# EAGLE design nrf52_breakout_rev_1 (EAGLE 9.1.3)
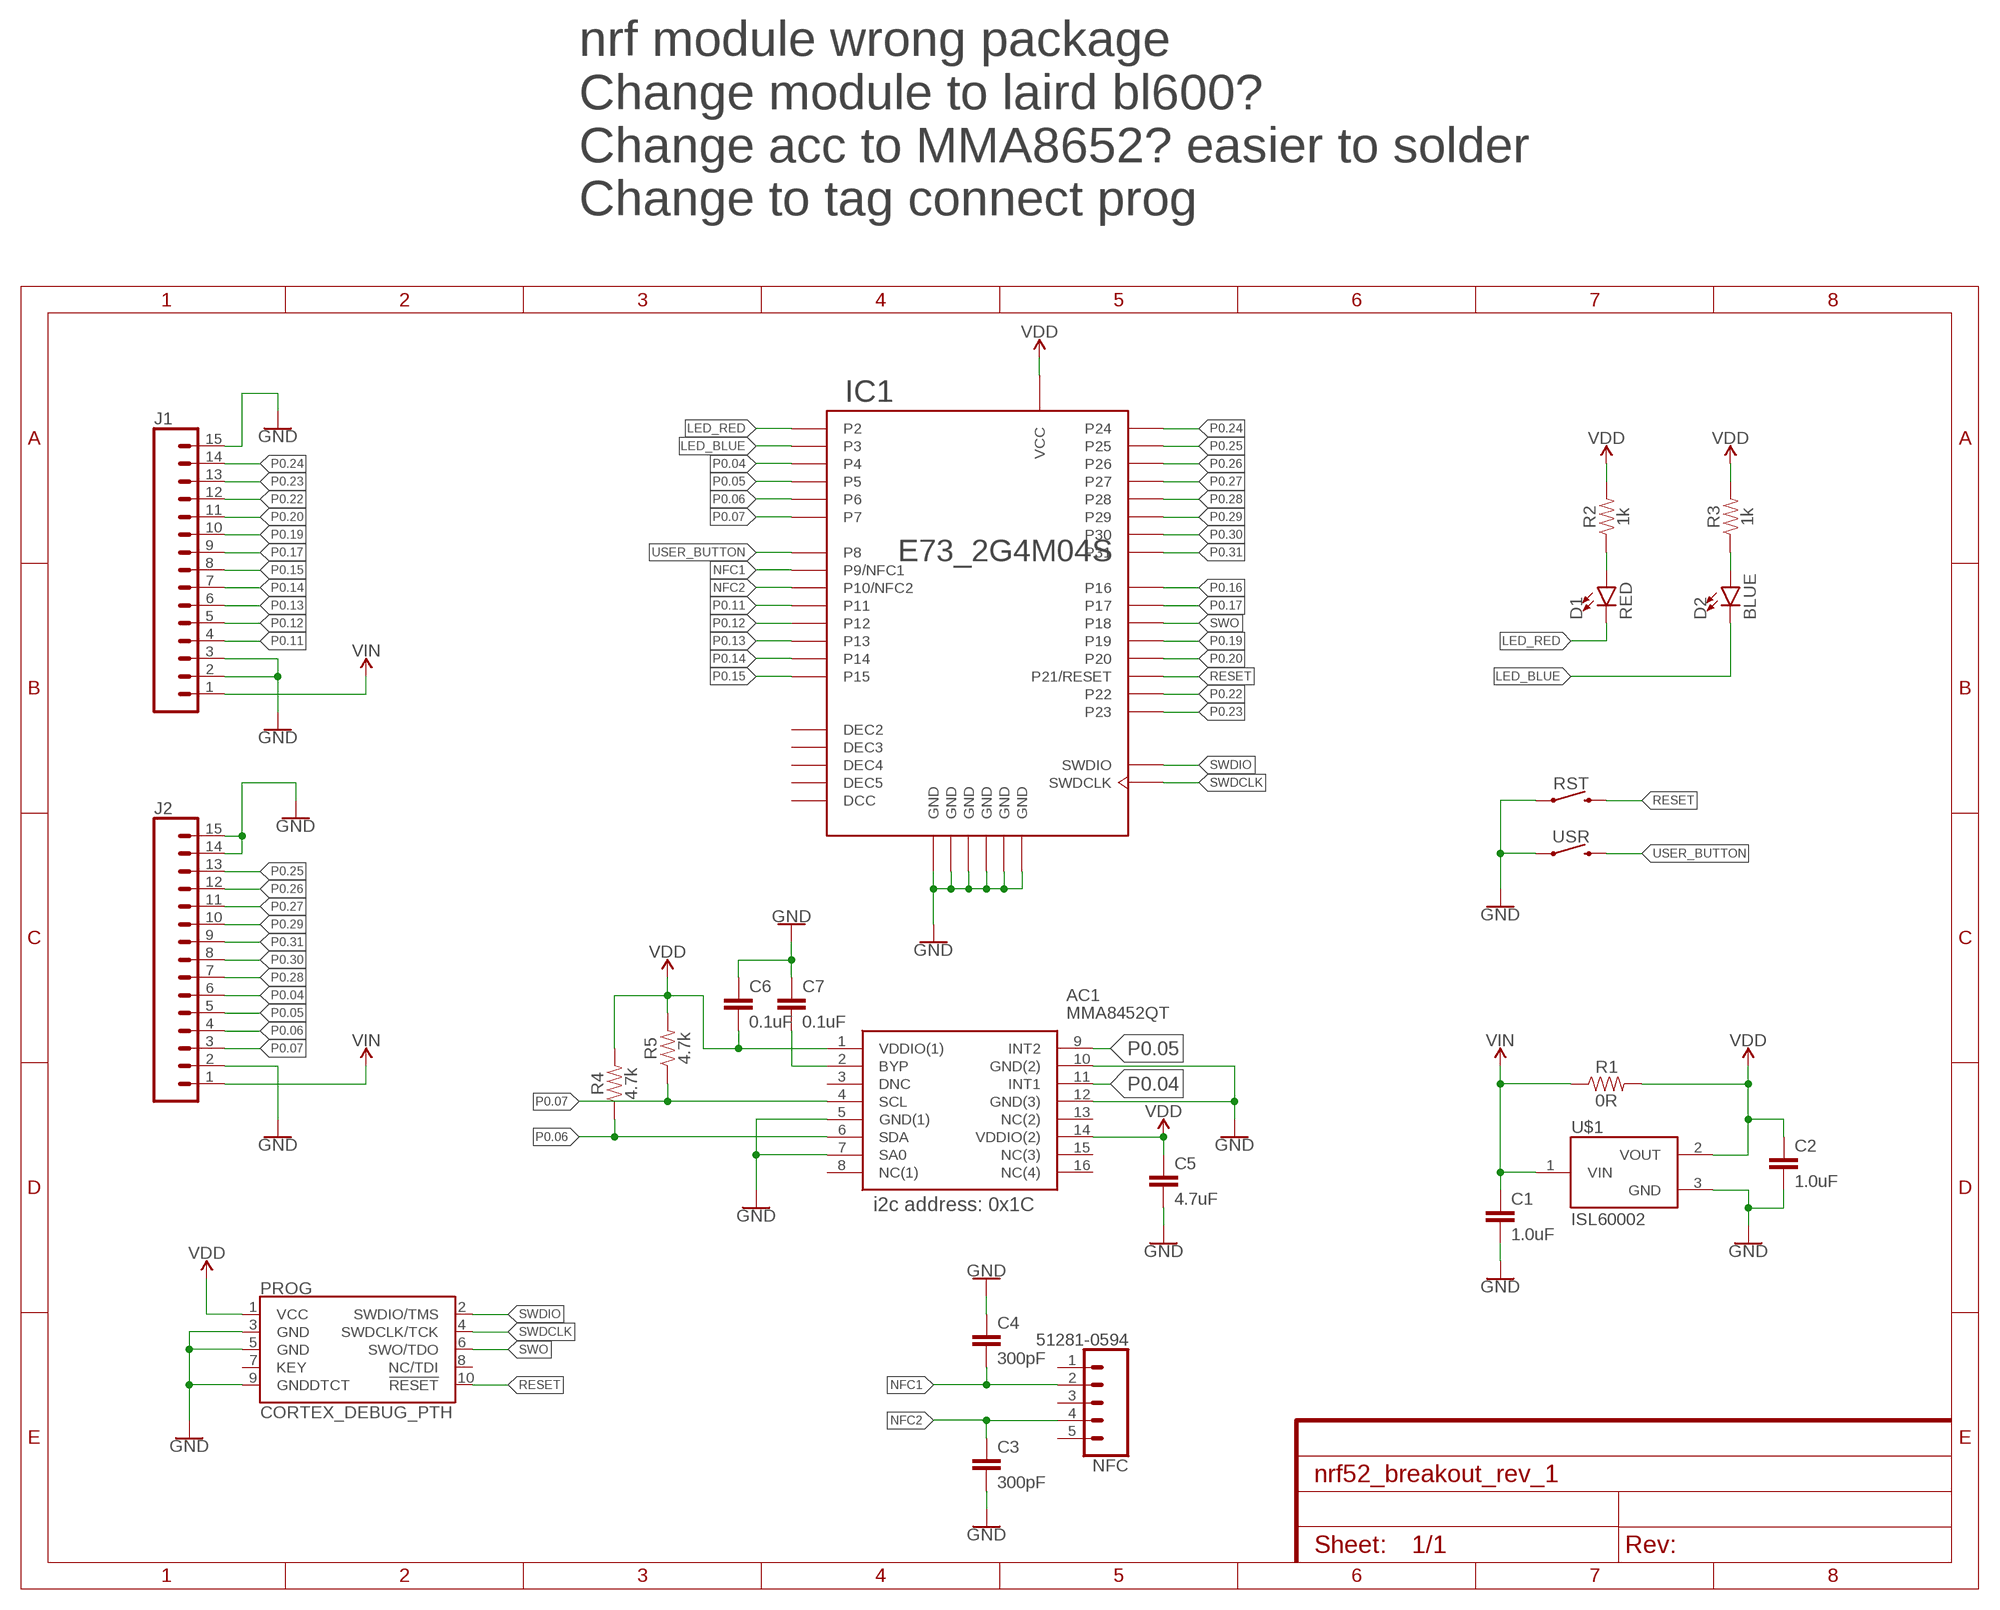
[diagram p0: schematic, sheet 1]

## Parts
AC1  MMA8452QT  [PQFN50P300X300X100-16N]
C1  1.0uF  1.0UF-0603-16V-10%  [0603]
C2  1.0uF  1.0UF-0603-16V-10%  [0603]
C3  300pF  470NF-0402-16V-10%  [0402]
C4  300pF  470NF-0402-16V-10%  [0402]
C5  4.7uF  4.7UF0603  [0603]
C6  0.1uF  0.1UF-0402-16V-10%  [0402]
C7  0.1uF  0.1UF-0402-16V-10%  [0402]
D1  RED  LED-RED0603  [LED-0603]
D2  BLUE  LED-BLUE0603  [LED-0603]
IC1  E73_2G4M04S  [E73_2G4M04S]
J1  CONN_15  [1X15]
J2  CONN_15  [1X15]
NFC  51281-0594  [51281-0594]
PROG  CORTEX_DEBUG_PTH  [2X5-PTH-1.27MM]
R1  0R  RESISTOR0603  [0603]
R2  1k  RESISTOR0603  [0603]
R3  1k  RESISTOR0603  [0603]
R4  4.7k  RESISTOR0402  [0402]
R5  4.7k  RESISTOR0402  [0402]
RST  MOMENTARY-SWITCH-SPST-SMD-4.6X2.8MM  [TACTILE_SWITCH_SMD_4.6X2.8MM]
U$1  ISL60002  [SOT23-3]
USR  MOMENTARY-SWITCH-SPST-SMD-4.6X2.8MM  [TACTILE_SWITCH_SMD_4.6X2.8MM]

## Nets
GND: AC1.5(GND(1)) AC1.7(SA0) AC1.10(GND(2)) AC1.12(GND(3)) C1.2 C2.2 C3.2 C4.1 C5.2 C6.1 C7.1 IC1.0(GND) IC1.1(GND) IC1.2(GND) IC1.15(GND) IC1.42(GND) IC1.43(GND) J1.2 J1.3 J1.15 J2.2 J2.14 J2.15 PROG.3(GND) PROG.5(GND) PROG.9(GNDDTCT) RST.1 RST.2 U$1.3(GND) USR.1 USR.2
LED_BLUE: D2.C IC1.18(P3)
LED_RED: D1.C IC1.17(P2)
N$1: D2.A R3.1
N$2: D1.A R2.1
N$6: AC1.2(BYP) C7.2
NFC1: C4.2 IC1.24(P9/NFC1) NFC.2
NFC2: C3.1 IC1.25(P10/NFC2) NFC.4
P0.04: AC1.11(INT1) IC1.19(P4) J2.6
P0.05: AC1.9(INT2) IC1.20(P5) J2.5
P0.06: AC1.6(SDA) IC1.21(P6) J2.4 R4.1
P0.07: AC1.4(SCL) IC1.22(P7) J2.3 R5.1
P0.11: IC1.26(P11) J1.4
P0.12: IC1.27(P12) J1.5
P0.13: IC1.28(P13) J1.6
P0.14: IC1.29(P14) J1.7
P0.15: IC1.30(P15) J1.8
P0.16: IC1.31(P16)
P0.17: IC1.32(P17) J1.9
P0.19: IC1.34(P19) J1.10
P0.20: IC1.35(P20) J1.11
P0.22: IC1.39(P22) J1.12
P0.23: IC1.40(P23) J1.13
P0.24: IC1.41(P24) J1.14
P0.25: IC1.5(P25) J2.13
P0.26: IC1.6(P26) J2.12
P0.27: IC1.7(P27) J2.11
P0.28: IC1.8(P28) J2.7
P0.29: IC1.9(P29) J2.10
P0.30: IC1.10(P30) J2.8
P0.31: IC1.11(P31) J2.9
RESET: IC1.36(P21/RESET) PROG.10(!RESET) RST.3 RST.4
SWDCLK: IC1.37(SWDCLK) PROG.4(SWDCLK/TCK)
SWDIO: IC1.38(SWDIO) PROG.2(SWDIO/TMS)
SWO: IC1.33(P18) PROG.6(SWO/TDO)
USER_BUTTON: IC1.23(P8) USR.3 USR.4
VDD: AC1.1(VDDIO(1)) AC1.14(VDDIO(2)) C2.1 C5.1 C6.2 IC1.16(VCC) PROG.1(VCC) R1.2 R2.2 R3.2 R4.2 R5.2 U$1.2(VOUT)
VIN: C1.1 J1.1 J2.1 R1.1 U$1.1(VIN)
Unconnected: AC1.3(DNC) AC1.8(NC(1)) AC1.13(NC(2)) AC1.15(NC(3)) AC1.16(NC(4)) NFC.1 NFC.3 NFC.5 PROG.7(KEY) PROG.8(NC/TDI)

## Notes on the sheet
- nrf module wrong package
  Change module to laird bl600?
  Change acc to MMA8652? easier to solder
  Change to tag connect prog
- i2c address: 0x1C

## Power pins joined to a net without a drawn wire
DCC: IC1.13(DCC)
DEC2: IC1.3(DEC2)
DEC3: IC1.4(DEC3)
DEC4: IC1.12(DEC4)
DEC5: IC1.14(DEC5)

## Library data of the parts
AC1 = BauckLib:MMA8452QT: Accelerometers LOW G 3-AXIS 12BT EX VLT Source: Datasheet <http://docs-europe.electrocomponents.com/webdocs/12de/0900766b812de994.pdf>; DESCRIPTION: Accelerometers LOW G 3-AXIS 12BT EX VLT; HEIGHT: 1mm; MANUFACTURER_NAME: Nexperia; MANUFACTURER_PART_NUMBER: MMA8452QT; RS_PART_NUMBER: 9227526; SUPPLIER_NAME: RS
C1 C2 = SparkFun-Capacitors:1.0UF: 1µF ceramic capacitors A capacitor is a passive two-terminal electrical component used to store electrical energy temporarily in an electric field.; PROD_ID: CAP-00868
C3 C4 = SparkFun-Capacitors:470NF: 0.47uF/470nF ceramic capacitors A capacitor is a passive two-terminal electrical component used to store electrical energy temporarily in an electric field.; PROD_ID: CAP-09041; VALUE: 470nF
C5 = SparkFun-Capacitors:4.7UF: 4.7µF ceramic capacitors A capacitor is a passive two-terminal electrical component used to store electrical energy temporarily in an electric field.; PROD_ID: CAP-08280
C6 C7 = SparkFun-Capacitors:0.1UF: 0.1µF ceramic capacitors A capacitor is a passive two-terminal electrical component used to store electrical energy temporarily in an electric field.; PROD_ID: CAP-12416
D1 = SparkFun-LED:LED-RED: Red SMD LED Used in manufacturing of most products at SparkFun Packages: 0603 - SMD 0603 package [Product Link] <http://docs.avagotech.com/docs/AV02-0551EN> 0603 SMART - SMD 0603 SMART package ( more efficient and expensive)[Product Link] <http://www.osram-os.com/Graphics/XPic2/00077099_0.pdf> 1206 - SMD1206 package [Product Link] <https://www.sparkfun.com/datasheets/DevTools/LilyPad/Q150OVS4.pdff> SparkFun Products: Pro Mini 328 -5V <https://www.sparkfun.com/products/821> RedBoard <https://www.sparkfun.com/products/12757> IOIO-OTG <https://www.sparkfun.com/products/13613>; PROD_ID: DIO-00819
D2 = SparkFun-LED:LED-BLUE: Blue SMD LED Used in manufacturing of various products at SparkFun Packages: 0603 - SMD 0603 package [Product Link] <http://www.digikey.com/product-detail/en/SMLE12BC7TT86/511-1589-2-ND/1641808> 1206 - SMD1206 package [Product Link] <http://www.digikey.com/product-detail/en/lite-on-inc/LTST-C150TBKT/160-1643-1-ND/573584> SparkFun Products: ESP8266 Thing-Dev Board <https://www.sparkfun.com/products/13711> RedBoard <https://www.sparkfun.com/products/12757>; PROD_ID: DIO-08575
IC1 = BauckLib:E73_2G4M04S
J1 J2 = SparkFun-Connectors:CONN_15: Multi connection point. Often used as Generic Header-pin footprint for 0.1 inch spaced/style header connections On any of the 0.1 inch spaced packages, you can populate with these: Break Away Headers - Straight <https://www.sparkfun.com/products/116> (PRT-00116) Break Away Male Headers - Right Angle <https://www.sparkfun.com/products/553> (PRT-00553) Female Headers <https://www.sparkfun.com/products/115> (PRT-00115) Break Away Headers - Machine Pin <https://www.sparkfun.com/products/117> (PRT-00117) Break Away Female Headers - Swiss Machine Pin <https://www.sparkfun.com/products/743> (PRT-00743) For SCREWTERMINALS and SPRING TERMINALS visit here: Screw Terimnals on SparkFun.com <https://www.sparkfun.com/search/results?term=Screw+Terminals> (5mm/3.5mm/2.54mm spacing) This device is also useful as a general connection point to wire up your design to another part of your project. Our various solder wires solder well into these plated through hole pads. Hook-Up Wire - Assortment (Stranded, 22 AWG) <https://www.sparkfun.com/products/11375> (PRT-11375) Hook-Up Wire - Assortment (Solid Core, 22 AWG) <https://www.sparkfun.com/products/11367> (PRT-11367) View the entire wire category on our website here <https://www.sparkfun.com/categories/141> Special notes: Molex polarized connector foot print use with SKU : PRT-08231 with associated crimp pins and housings. 1MM SMD Version SKU: PRT-10208 NOTES ON THE VARIANTS LOCK and LOCK_LONGPADS... This footprint was designed to help hold the alignment of a through-hole component (i.e. 6-pin header) while soldering it into place. You may notice that each hole has been shifted either up or down by 0.005 of an inch from it's more standard position (which is a perfectly straight line). This slight alteration caused the pins (the squares in the middle) to touch the edges of the holes. Because they are alternating, it causes a "brace" to hold the component in place. 0.005 has proven to be the perfect amount of "off-center" position when using our standard breakaway headers. Although looks a little odd when you look at the bare footprint, once you have a header in there, the alteration is very hard to notice. Also,if you push a header all the way into place, it is covered up entirely on the bottom side.
NFC = BauckLib:51281-0594: FFC & FPC Connectors 0.5 FPC Non-ZIF 5Ckt Dual Contact Source: Datasheet <http://www.molex.com/pdm_docs/sd/512810594_sd.pdf>; DESCRIPTION: FFC & FPC Connectors 0.5 FPC Non-ZIF 5Ckt Dual Contact; HEIGHT: mm; MANUFACTURER_NAME: Molex; MANUFACTURER_PART_NUMBER: 51281-0594; SUPPLIER_NAME: RS
PROG = SparkFun-Connectors:CORTEX_DEBUG: Cortex Debug Connector - 10 pin Supports JTAG debug, Serial Wire debug, and Serial Wire Viewer. PTH and SMD connector options available. General Connector Information <http://infocenter.arm.com/help/topic/com.arm.doc.faqs/attached/13634/cortex_debug_connectors.pdf> Products: PTH Connector <http://www.digikey.com/product-detail/en/cnc-tech/3220-10-0100-00/1175-1627-ND/3883661> -via Digi-Key SparkFun PSoc <https://www.sparkfun.com/products/13229> SparkFun T <https://www.sparkfun.com/products/13810>
R1-R5 = SparkFun-Resistors:RESISTOR: Generic Resistor Package
RST USR = SparkFun-Switches:MOMENTARY-SWITCH-SPST: Momentary Switch (Pushbutton) - SPST Normally-open (NO) SPST momentary switches (buttons, pushbuttons). Variants PTH-12MM - 12mm square, through-hole Momentary Pushbutton Switch - 12mm Square <https://www.sparkfun.com/products/9190> (COM-09190) PTH-6.0MM, PTH-6.0MM-KIT - 6.0mm square, through-hole Mini Pushbutton Switch <https://www.sparkfun.com/products/97> (COM-00097) KIT package intended for soldering kit's - only one side of pads' copper is exposed. PTH-RIGHT-ANGLE-KIT - Right-angle, through-hole Right Angle Tactile Button <https://www.sparkfun.com/products/10791> - Used on SparkFun BigTime Watch Kit <https://www.sparkfun.com/products/11734> SMD-12MM - 12mm square, surface-mount Tactile Button - SMD (12mm) <https://www.sparkfun.com/products/12993> (COM-12993) Used on SparkFun PicoBoard <https://www.sparkfun.com/products/11888> SMD-4.5MM - 4.5mm Square Trackball Switch Used on SparkFun Blackberry Trackballer Breakout <https://www.sparkfun.com/products/13169> SMD-4.6MMX2.8MM - 4.60mm x 2.80mm, surface mount Used on SparkFun SAMD21 Mini Breakout <https://www.sparkfun.com/products/13664> SMD-5.2MM, SMD-5.2-REDUNDANT - 5.2mm square, surface-mount Mini Pushbutton Switch - SMD <https://www.sparkfun.com/products/8720> (COM-08720) Used on Arduino Pro Mini <https://www.sparkfun.com/products/11114> REDUNDANT package connects both switch circuits together SMD-6.0X3.5MM - 6.0 x 3.5mm, surface mount Momentary Reset Switch SMD <https://www.sparkfun.com/products/8229> (COM-08229) SMD-6.2MM-TALL - 6.2mm square, surface mount Tactile Button - SMD (6mm) <https://www.sparkfun.com/products/12992> Used on SparkFun Digital Sandbox <https://www.sparkfun.com/products/12651> SMD-RIGHT-ANGLE - Right-angle, surface mount Used on SparkFun Block for Intel® Edison - Arduino <https://www.sparkfun.com/products/13036>; PROD_ID: SWCH-13065
U$1 = BauckLib:ISL60002

## Board
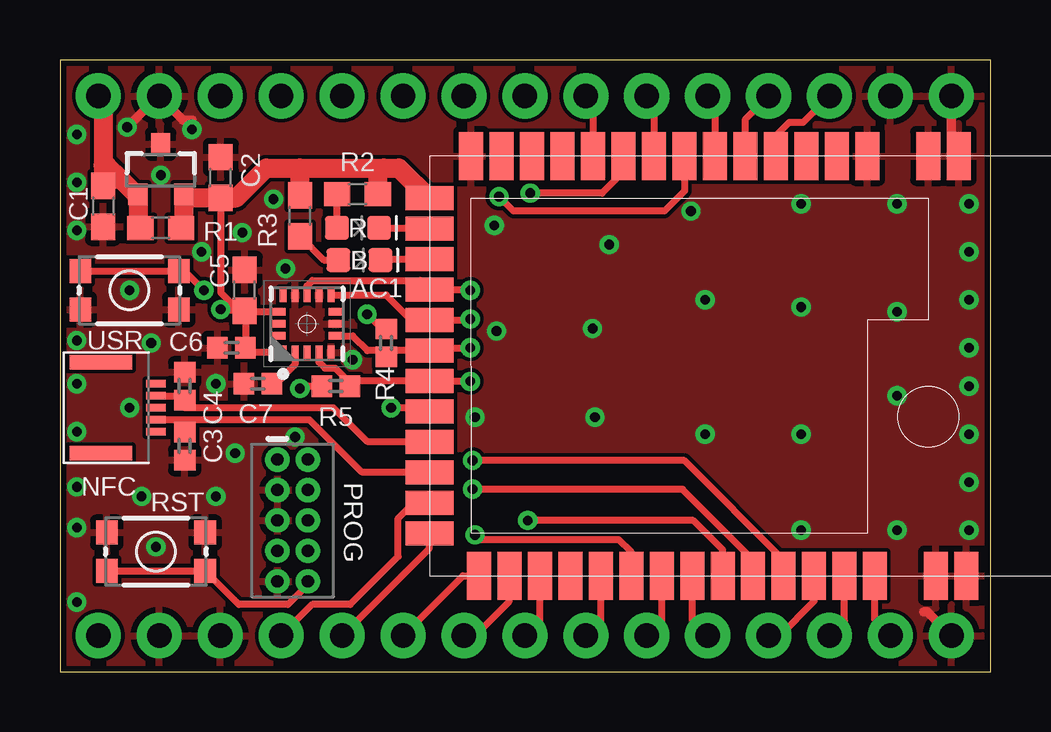
[diagram p1: board, top side]
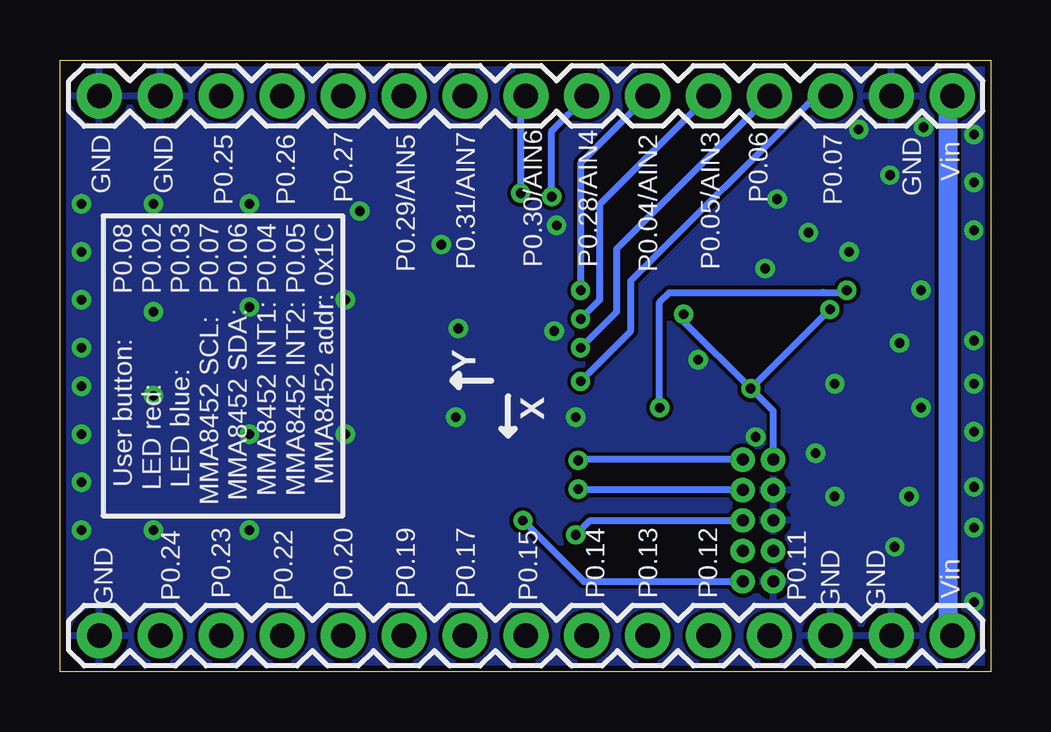
[diagram p2: board, bottom side, seen from below]

Size 38.8 x 25.5 mm. Coordinates in mm from the lower left corner, seen from the top.
Outline: 0,0 38.8,0 38.8,25.5 0,25.5 0,0
Copper layers (1*16): Top 0.035mm / dielectric 1.5mm / Bottom 0.035mm
Design rules "Elecrow_2-layer_eagle_rule": minimum track width 6mil, minimum drill 12mil, track to track 6mil, track to pad 6mil, pad to pad 6mil, via to via 6mil, smd to smd 0mil, copper to edge 10mil, drill to drill 10mil, minimum pad ring 10mil, minimum via ring 6mil, stop-mask expansion 2mil, vias tented up to drill 100mil, thermal gap 10mil

### Footprints (pad centres in the part's own frame; a part is rotated, then mirrored left to right if it is on the bottom)
PQFN50P300X300X100-16N = smd 0.6 x 0.3: 1 -1.2,1; 2 -1.2,0.5; 3 -1.2,0; 4 -1.2,-0.5; 5 -1.2,-1; 9 1.2,-1; 10 1.2,-0.5; 11 1.2,0; 12 1.2,0.5; 13 1.2,1 | smd 0.3 x 0.6: 6 -0.5,-1.2; 7 0,-1.2; 8 0.5,-1.2; 14 0.5,1.2; 15 0,1.2; 16 -0.5,1.2
0603 = smd 1.1 x 1: 1 -0.85,0; 2 0.85,0
0402 = smd 0.85 x 0.9: 1 -0.58,0; 2 0.58,0
LED-0603 = smd 1 x 1: A -0.877,0; C 0.877,0
E73_2G4M04S = smd 1 x 2: 0 22.065,17.5; 1 20.795,17.5; 2 18.255,17.5; 3 16.985,17.5; 4 15.715,17.5; 5 14.445,17.5; 6 13.175,17.5; 7 11.905,17.5; 8 10.635,17.5; 9 9.365,17.5; 10 8.095,17.5; 11 6.825,17.5; 12 5.555,17.5; 13 4.285,17.5; 14 3.015,17.5; 15 1.745,17.5; 28 2.065,0; 29 3.335,0; 30 4.605,0; 31 5.875,0; 32 7.145,0; 33 8.415,0; 34 9.685,0; 35 10.955,0; 36 12.225,0; 37 13.495,0; 38 14.765,0; 39 16.035,0; 40 17.305,0; 41 18.575,0; 42 21.115,0; 43 22.385,0 | smd 2 x 1: 16 0,15.735; 17 0,14.465; 18 0,13.195; 19 0,11.925; 20 0,10.655; 21 0,9.385; 22 0,8.115; 23 0,6.845; 24 0,5.575; 25 0,4.305; 26 0,3.035; 27 0,1.765
1X15 = drill 1.016 pad 1.88: 1 0,0; 2 2.54,0; 3 5.08,0; 4 7.62,0; 5 10.16,0; 6 12.7,0; 7 15.24,0; 8 17.78,0; 9 20.32,0; 10 22.86,0; 11 25.4,0; 12 27.94,0; 13 30.48,0; 14 33.02,0; 15 35.56,0
51281-0594 = smd 0.3 x 0.8: 1 -1,0; 2 -0.5,0; 3 0,0; 4 0.5,0; 5 1,0 | smd 0.6 x 2.6: 6 -1.9,-2.3; 7 1.9,-2.3
2X5-PTH-1.27MM = drill 0.508 pad 1: 1 -2.54,-0.635; 2 -2.54,0.635; 3 -1.27,-0.635; 4 -1.27,0.635; 5 0,-0.635; 6 0,0.635; 7 1.27,-0.635; 8 1.27,0.635; 9 2.54,-0.635; 10 2.54,0.635
TACTILE_SWITCH_SMD_4.6X2.8MM = smd 0.9 x 1: 1 -2.05,-0.8; 2 2.05,-0.8; 3 2.05,0.8; 4 -2.05,0.8
SOT23-3 = smd 0.8 x 0.9: 1 -0.95,-1; 2 0.95,-1; 3 0,1.1

### Placement (x,y rotation side)
AC1  10.3,14.5 90 top
C1  1.8,19.4 270 top
C2  6.7,20.6 90 top
C3  5.2,9.4 270 top
C4  5.2,11.9 270 top
C5  7.7,15.9 90 top
C6  7.15,13.5 0 top
C7  8.25,12 0 top
D1  12.42,18.5 0 top
D2  12.48,17.16 0 top
IC1  15.4,4 0 top
J1  1.6,1.5 180 bottom
J2  1.6,24 180 bottom
NFC  4,11 270 top
PROG  9.7,6.3 270 top
R1  4.2,18.5 0 top
R2  12.4,19.9 0 top
R3  10,19 90 top
R4  13.6,13.7 90 top
R5  11.5,11.9 180 top
RST  4,5 180 top
U$1  4.2,20.9 0 top
USR  2.9,15.9 0 top

### Tracks (layer width: path | path; a pad name or v marks a point on that pad's centre or on a via)
GND  (via drill 0.4 pad 0.8)
  Top 0.4: J1.15 36.16,2.5 36,2.5 | 5.5,23 5.14,23 J2.2 4.1,24 v2.8,22.7 | J2.15 37.16,22.34 37.5,22
  other vias: 3.8,13.7 3.4,7.3 2.9,11 5.5,22.6 37.9,19.5 37.9,17.5 37.9,15.5 37.9,13.5 37.9,5.9 37.9,7.9 37.9,9.9 37.9,11.9 34.9,19.5 26.3,19.2 30.9,19.5 34.9,5.9 30.9,5.9 26.9,9.9 30.9,9.9 34.9,11.5 34.9,15 30.9,15.2 26.9,15.5 17.3,10.6 22.9,17.8 22.2,14.3 22.3,10.6 7.3,9.1 4,5.2 6.5,7.3 0.7,2.9 0.7,22.4 0.7,18.4 0.7,20.4 0.7,13.8 0.7,12 0.7,10 0.7,7.7 0.7,6 9.4,16.8 12.2,13 7.6,18.3 8.9,19.7 5.9,17.5 4.2,20.7 2.9,15.9 18.1,18.6 6.5,12 9.8,9.78 18.2,14.2
  pour Top: -4,29 44,29 46,27 46,1 39,-6 -4,-6 -9,-1 -9,24
  pour Bottom: -10,34 49,34 54,29 54,1 41,-12 -8,-12 -15,-5 -15,29
LED_BLUE
  Top 0.3: D2.C 13.4,17.2 IC1.18
LED_RED
  Top 0.3: D1.C 15.37,18.5 IC1.17
N$1
  Top 0.3: R3.1 10.99,17.16 D2.A
N$2
  Top 0.3: D1.A R2.1
N$6
  Top 0.3: AC1.2 9.8,12.8 9,12 C7.2
NFC1
  Top 0.3: 14.68,9.57 IC1.24 12.82,9.57 11.4,11 5.2,11 C4.2 5.2,11.5 NFC.2
NFC2
  Top 0.3: 14.71,8.3 IC1.25 12.6,8.3 10.4,10.5 5.2,10.5 | 5.2,10.5 NFC.4 | C3.1 5.2,10.5
P0.04  (via drill 0.4 pad 0.8)
  Top 0.3: AC1.11 10.3,16.08 10.53,16.3 15.02,16.3 IC1.19 17.07,15.93 v17.1,15.9
  Bottom 0.3: v17.1,15.9 17.1,21.2 J2.6
P0.05  (via drill 0.4 pad 0.8)
  Top 0.3: AC1.9 13.6,15.7 14.64,14.65 IC1.20 17.05,14.65 v17.1,14.7
  Bottom 0.3: v17.1,14.7 16.3,15.5 16.3,19.46 J2.5
P0.06  (via drill 0.4 pad 0.8)
  Top 0.3: 13.5,13.38 IC1.21 15.52,13.5 v17.1,13.5 | 13.5,13.38 12.81,13.38 12.2,14 AC1.6 | R4.1 13.5,13.22 13.5,13.38
  Bottom 0.3: v17.1,13.5 15.6,15 15.6,17.62 J2.4
P0.07  (via drill 0.4 pad 0.8)
  Top 0.3: 12.01,12.12 IC1.22 17.09,12.12 v17.1,12.1 | 12.01,12.12 11.47,12.65 11.05,12.65 10.8,12.9 AC1.4 | R5.1 12.01,11.97 12.01,12.12
  Bottom 0.3: 7.1,24 J2.3 7.3,24 15,16.3 15,14.2 v17.1,12.1
P0.11
  Top 0.3: 14.63,7.04 IC1.26 14.74,7.04 14.1,6.39 14.1,4.8 12.1,2.8 10.52,2.8 J1.4
P0.12
  Top 0.3: IC1.27 15.4,5.14 J1.5
P0.13
  Top 0.3: IC1.28 16.8,4 J1.6
P0.14
  Top 0.3: IC1.29 18.73,2.94 17.3,1.5 J1.7
P0.15
  Top 0.3: IC1.30 20,2.12 J1.8
P0.17
  Top 0.3: IC1.32 22.55,2.12 J1.9
P0.19
  Top 0.3: IC1.34 25.09,2.12 J1.10
P0.20
  Top 0.3: IC1.35 26.36,2.15 J1.11
P0.22
  Top 0.3: IC1.39 31.43,2.94 30,1.5 J1.12
P0.23
  Top 0.3: IC1.40 32.7,2.12 J1.13
P0.24
  Top 0.3: IC1.41 33.98,2.15 J1.14
P0.25
  Top 0.3: IC1.5 29.84,22.34 30.4,22.9 30.98,22.9 J2.13
P0.26
  Top 0.3: IC1.6 28.57,23.04 J2.12
P0.27
  Top 0.3: IC1.7 27.3,23.7 J2.11
P0.28  (via drill 0.4 pad 0.8)
  Top 0.3: IC1.8 26.04,20.04 25.2,19.2 18.9,19.2 v18.3,19.8
  Bottom 0.3: v18.3,19.8 18.3,22.5 18.3,22.54 J2.7
P0.29
  Top 0.3: IC1.9 24.77,23.7 J2.10
P0.30  (via drill 0.4 pad 0.8)
  Top 0.3: v19.6,19.95 22.6,19.95 23.5,20.84 IC1.10
  Bottom 0.3: v19.6,19.95 19.6,23.78 J2.8
P0.31
  Top 0.3: IC1.11 22.23,23.7 J2.9
RESET  (via drill 0.4 pad 0.8)
  Top 0.3: IC1.36 27.62,5.08 26.4,6.3 v19.5,6.3 | PROG.10 10.34,3.63 9.5,2.8 7.45,2.8 RST.4 RST.3
  Bottom 0.3: v19.5,6.3 16.96,3.76 PROG.10
SWDCLK  (via drill 0.4 pad 0.8)
  Top 0.3: v17.2,7.6 25.95,7.6 28.89,4.66 IC1.37
  Bottom 0.3: PROG.4 17.17,7.57 v17.2,7.6
SWDIO  (via drill 0.4 pad 0.8)
  Top 0.3: v17.2,8.8 26.02,8.8 30.16,4.66 IC1.38
  Bottom 0.3: PROG.2 17.16,8.84 v17.2,8.8
SWO  (via drill 0.4 pad 0.8)
  Top 0.3: IC1.33 23.82,4.99 23.3,5.5 17.5,5.5 v17.3,5.7
  Bottom 0.3: v17.3,5.7 16.7,6.3 PROG.6
USER_BUTTON  (via drill 0.4 pad 0.8)
  Top 0.3: USR.4 USR.3 5.2,16.7 v6,15.9 | IC1.23 15.24,11 v13.8,11
  Bottom 0.3: v13.8,11 13.8,15.4 13.4,15.8 6.99,15.8 6.09,15.8 v6,15.9
VDD  (via drill 0.4 pad 0.8)
  Top 0.3: v12.8,14.9 13.42,14.28 R4.2 | v10,11.8 10.1,11.9 R5.2 | AC1.1 7.93,13.3 C6.2 7.73,15.02 C5.1 | AC1.14 7.75,15 C5.1 | C2.1 6.7,15.8 7.45,15.05 C5.1 | C5.1 6.75,15.05 v6.7,15.1
  Top 0.8: R1.2 5.15,18.6 U$1.2 5.3,19.75 C2.1 7.35,19.75 8.6,21 10,21 | IC1.16 14.13,21 13.5,21 | 10,21 13.5,21 | R3.2 10,21 | R2.2 13.25,20.75 13.5,21
  Bottom 0.3: v6.7,15.1 v10,11.8 | PROG.1 9.06,10.87 v10,11.8 | v12.8,14.9 12.8,14.6 v10,11.8
VIN
  Top 0.8: 2.52,20.52 3.15,19.9 U$1.1 3.25,18.6 R1.1 | 2.52,20.52 1.88,20.52 C1.1 1.8,21.1 | 1.8,21.1 1.8,23.8 J2.1 | 2.52,20.52 1.95,21.1 1.8,21.1
  Bottom 0.8: J1.1 1.8,1.7 1.8,23.8 J2.1

### Text on the board
bPlace: P0.28/AIN4 | P0.30/AIN6 | Vin | GND | P0.07 | P0.06 | P0.05/AIN3 | P0.04/AIN2 | P0.31/AIN7 | P0.29/AIN5 | P0.27 | P0.26 | P0.25 | GND | GND | User button: P0.08 / LED red: P0.02 / LED blue: P0.03 / MMA8452 SCL: P0.07 / MMA8452 SDA: P0.06 / MMA8452 INT1: P0.04 / MMA8452 INT2: P0.05 / MMA8452 addr: 0x1C | Y | X | P0.11 | P0.12 | P0.13 | P0.14 | P0.15 | P0.17 | P0.19 | P0.20 | P0.22 | P0.23 | P0.24 | Vin | GND | GND | GND
tNames: R | B